# Altium project PA_8CH_CTRL.PrjPcb (part 3 of 3)

## Sheet Power_Supply.SchDoc: Power supply
size 420 x 297 mm; Author: G.K.; CompanyName: WUT; DrawnBy: G.K.; Organization: WUT ISE; Address1: Warsaw Univeristy of Technology; Address2: Nowowiejska 15/19; Revision: -; SheetNumber: -; SheetTotal: -; EDA_Number: ARTIQ; Projet: 8 Channel RF Power Amplifier; ModifiedBy: -; CreateDate: XX/XX/XXXX; CheckedDate: -; Title2: & Power Good detector; DivGrp: ISE; Designer: G.K.; ModifiedDate: -; ProjectName: 8 Channel RF Power Amplifier
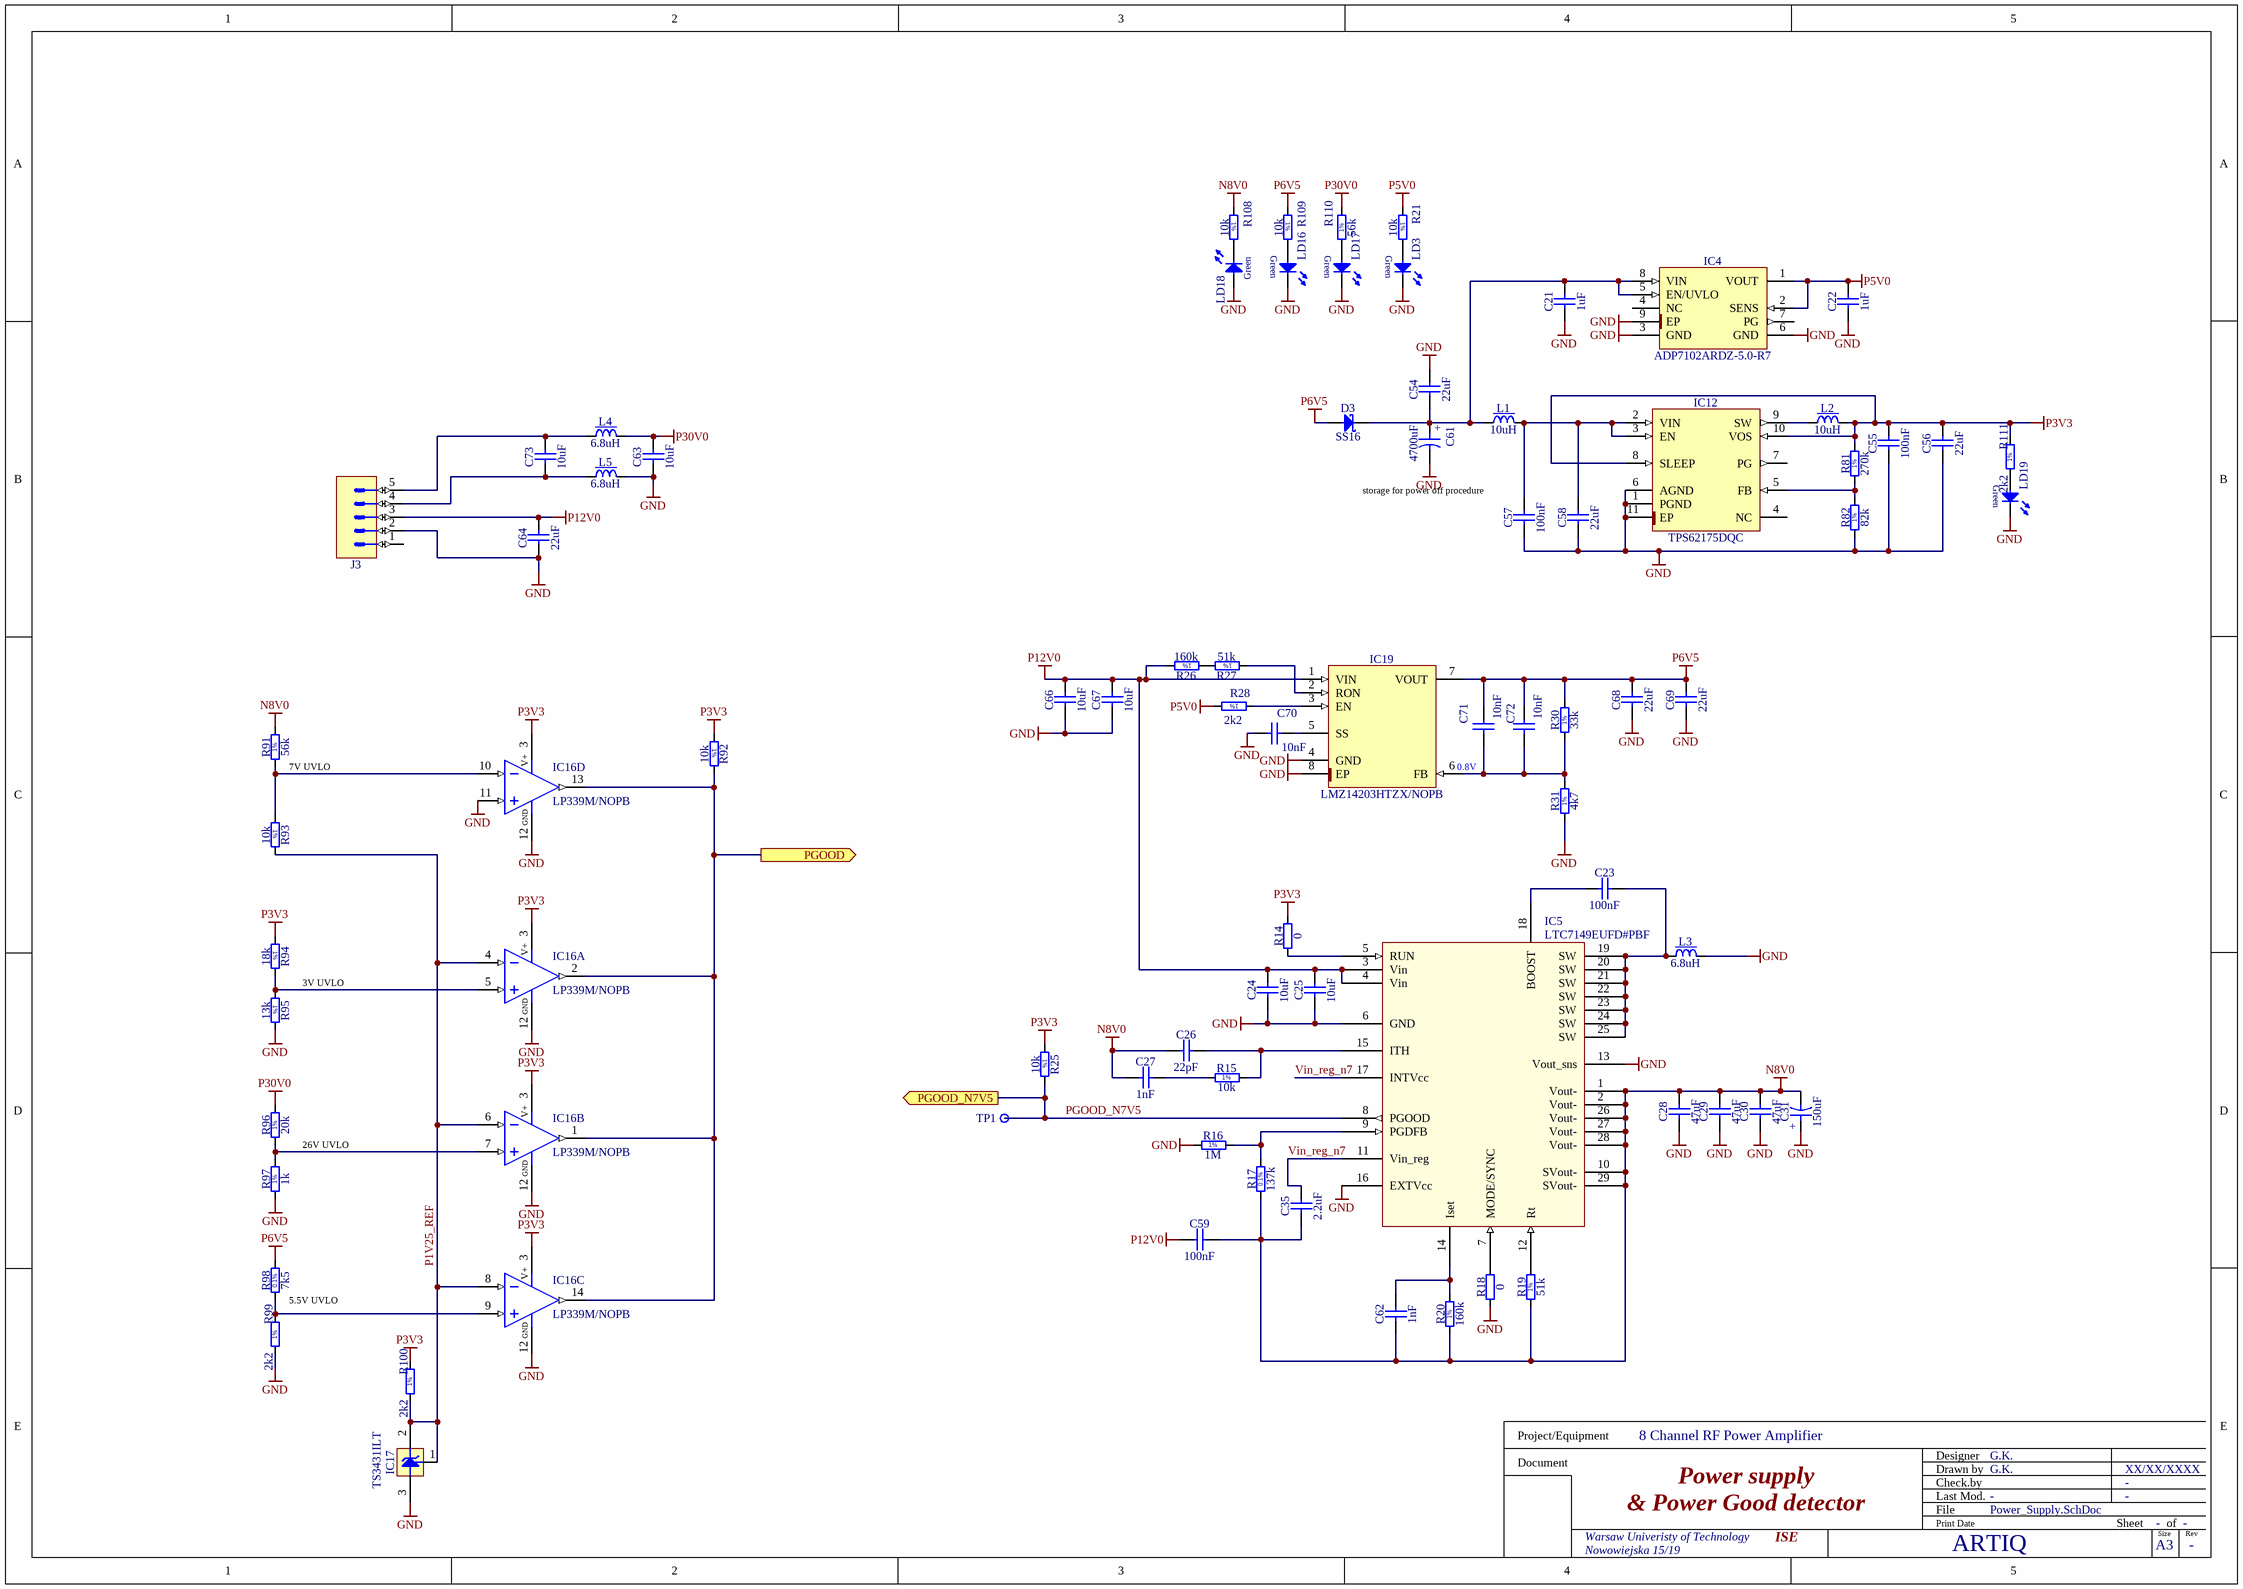
[diagram p3: Power_Supply.SchDoc]

### Parts
C21  1uF  [CAPC2012X140N]
C22  1uF  [CAPC2012X140N]
C23  100nF  [CAPC1005X55N]
C24  10uF  [CAPC3216X190N]
C25  10uF  [CAPC3216X190N]
C26  22pF  [CAPC1005X55N]
C27  1nF  [CAPC1005X55N]
C28  47uF  [CAPC3216X180N]
C29  47uF  [CAPC3216X180N]
C30  47uF  [CAPC3216X180N]
C31  150uF  [CAPMP7343X310N]
C35  2.2uF  [CAPC1608X87N]
C54  22uF  [CAPC2012X135N]
C55  100nF  [CAPC1005X55N]
C56  22uF  [CAPC2012X135N]
C57  100nF  [CAPC1005X55N]
C58  22uF  [CAPC2012X135N]
C59  100nF  [CAPC1608X87N]
C61  4700uF  [CAPAE1900X1680N]
C62  1nF  [CAPC1005X55N]
C63  10uF  [CAPC3216X190N]
C64  22uF  [CAPC2012X135N]
C66  10uF  [CAPC3216X190N]
C67  10uF  [CAPC3216X190N]
C68  22uF  [CAPC2012X135N]
C69  22uF  [CAPC2012X135N]
C70  10nF  [CAPC1608X87N]
C71  10nF  [CAPC1608X87N]
C72  10nF  [CAPC1608X87N]
C73  10uF  [CAPC3216X190N]
D3  SS16  [DIOM5127X229N]
IC4  ADP7102ARDZ-5.0-R7  [SOIC127P600X175-9N-R241X309]
IC5  LTC7149EUFD#PBF  [QFN50P400X500X80_HS-29N]
IC12  TPS62175DQC  [SON50P200X300X80-11N-R94X250]
IC16  LP339M/NOPB  [SOIC127P600X175-14N]  (parts A,B,C,D of 4)
IC17  TS3431ILT  [SOT95P237X112-3N]
IC19  LMZ14203HTZX/NOPB  [TEXAS_TO-PMOD (NDW)]
J3  (no value)  [PHOENIX_1755765]
L1  10uH  [IND_MURATA-PS_8400]
L2  10uH  [IND_MURATA-PS_8400]
L3  6.8uH  [INDM6965X300N]
L4  6.8uH  [INDM6965X300N]
L5  6.8uH  [INDM6965X300N]
LD3  Green  [LED_KINGBRIGHT_KPH-1608CGCK]  (value not drawn)
LD16  Green  [LED_KINGBRIGHT_KPH-1608CGCK]  (value not drawn)
LD17  Green  [LED_KINGBRIGHT_KPH-1608CGCK]  (value not drawn)
LD18  Green  [LED_KINGBRIGHT_KPH-1608CGCK]  (value not drawn)
LD19  Green  [LED_OSRAM_LGL29K]  (value not drawn)
R14  0  [RESC1005X40N]
R15  10k  [RESC1005X40N]
R16  1M  [RESC1005X40N]
R17  137k  [RESC1608X55N]
R18  0  [RESC1005X40N]
R19  51k  [RESC1005X40N]
R20  160k  [RESC1005X40N]
R21  10k  [RESC1005X40N]
R25  10k  [RESC1005X40N]
R26  160k  [RESC1005X40N]
R27  51k  [RESC1005X40N]
R28  2k2  [RESC1005X40N]
R30  33k  [RESC1608X55N]
R31  4k7  [RESC1608X55N]
R81  270k  [RESC1608X55N]
R82  82k  [RESC1608X55N]
R91  56k  [RESC1608X55N]
R92  10k  [RESC1005X40N]
R93  10k  [RESC1005X40N]
R94  18k  [RESC1608X55N]
R95  13k  [RESC1608X55N]
R96  20k  [RESC1608X55N]
R97  1k  [RESC1608X55N]
R98  7k5  [RESC1608X55N]
R99  2k2  [RESC1005X40N]
R100  2k2  [RESC1005X40N]
R108  10k  [RESC1005X40N]
R109  10k  [RESC1005X40N]
R110  56k  [RESC1608X55N]
R111  2k2  [RESC1005X40N]
TP1  Test Point  [TPS127]  (value not drawn)

### Ports
PGOOD (out), PGOOD_N7V5 (out)

### Nets
GND: C21.1 C22.1 C24.1 C25.1 C28.1 C29.1 C30.1 C31.1 C54.2 C55.1 C56.1 C57.1 C58.1 C61.2 C63.1 C64.1 C66.1 C67.1 C68.1 C69.1 C70.1 IC4.3(GND) IC4.6(GND) IC4.9(EP) IC5.6(GND) IC5.13(Vout_sns) IC5.16(EXTVcc) IC12.1(PGND) IC12.6(AGND) IC12.11(EP) IC16.11(IN+) IC16.12(GND) IC17.3(A) IC19.4(GND) IC19.8(EP) J3.2 L3.2 L5.2 LD3.1(C) LD16.1(C) LD17.1(C) LD18.2(A) LD19.1(C) R16.1 R18.1 R31.1 R82.1 R95.2 R97.1 R99.1
N8V0: C26.1 C27.1 C28.2 C29.2 C30.2 C31.2 C35.1 C59.2 C62.1 IC5.1(Vout-) IC5.2(Vout-) IC5.10(SVout-) IC5.26(Vout-) IC5.27(Vout-) IC5.28(Vout-) IC5.29(SVout-) R17.1 R19.1 R20.1 R91.2 R108.1
P3V3: C55.2 C56.2 IC12.8(SLEEP) IC12.10(VOS) IC16.3(V+) L2.2 R14.2 R25.1 R81.2 R92.1 R94.1 R100.2 R111.2
P5V0: C22.2 IC4.1(VOUT) IC4.2(SENS) R21.1 R28.2
P6V5: C68.2 C69.2 C71.2 C72.2 D3.2(A) IC19.7(VOUT) R30.2 R98.2 R109.1
P12V0: C24.2 C25.2 C59.1 C64.2 C66.2 C67.2 IC5.3(Vin) IC5.4(Vin) IC19.1(VIN) J3.3 R26.2
P30V0: C63.2 L4.2 R96.2 R110.2
P1V25_REF: IC16.4(IN-) IC16.6(IN-) IC16.8(IN-) IC17.1(Adj) IC17.2(C) R93.2 R100.1
PGOOD_N7V5: IC5.8(PGOOD) R25.2 TP1.1 ; port PGOOD_N7V5
Vin_reg_n7: C35.2 IC5.11(Vin_reg) IC5.17(INTVcc)
NetC21_2: C21.2 C54.1 C61.1 D3.1(C) IC4.5(EN/UVLO) IC4.8(VIN) L1.1
NetC23_1: C23.1 IC5.18(BOOST)
NetC23_2: C23.2 IC5.19(SW) IC5.20(SW) IC5.21(SW) IC5.22(SW) IC5.23(SW) IC5.24(SW) IC5.25(SW) L3.1
NetC26_2: C26.2 IC5.15(ITH) R15.2
NetC27_2: C27.2 R15.1
NetC57_2: C57.2 C58.2 IC12.2(VIN) IC12.3(EN) L1.2
NetC62_2: C62.2 IC5.14(Iset) R20.2
NetC70_2: C70.2 IC19.5(SS)
NetC71_1: C71.1 C72.1 IC19.6(FB) R30.1 R31.2
NetC73_1: C73.1 J3.4 L5.1
NetC73_2: C73.2 J3.5 L4.1
NetD2_1_1: IC16.1(OUT) IC16.2(OUT) IC16.13(OUT) IC16.14(OUT) R92.2 ; port PGOOD
NetIC5_5: IC5.5(RUN) R14.1
NetIC5_7: IC5.7(MODE/SYNC) R18.2
NetIC5_9: IC5.9(PGDFB) R16.2 R17.2
NetIC5_12: IC5.12(Rt) R19.2
NetIC12_5: IC12.5(FB) R81.1 R82.2
NetIC12_9: IC12.9(SW) L2.1
NetIC16_5: IC16.5(IN+) R94.2 R95.1
NetIC16_7: IC16.7(IN+) R96.1 R97.2
NetIC16_9: IC16.9(IN+) R98.1 R99.2
NetIC16_10: IC16.10(IN-) R91.1 R93.1
NetIC19_2: IC19.2(RON) R27.1
NetIC19_3: IC19.3(EN) R28.1
NetLD3_2: LD3.2(A) R21.2
NetLD16_2: LD16.2(A) R109.2
NetLD17_2: LD17.2(A) R110.1
NetLD18_1: LD18.1(C) R108.2
NetLD19_2: LD19.2(A) R111.1
NetR26_1: R26.1 R27.2

Not connected (* = marked no-connect by the designer): IC4 4(NC) 7(PG); IC12 4(NC) 7(PG); J3 1

### Notes on the sheet
- (near C57) storage for power off procedure
- (near R91) 7V UVLO
- 0.8V
- 3V UVLO
- 26V UVLO
- 5.5V UVLO
- Project/Equipment
- Document
- Designer
- Drawn by
- Check.by
- File
- Last Mod.
- Print Date
- Sheet
- Size
- A3
- of
- Rev
- (in symbol CAE1900-1680_4700UF_16V_20%) +
- (in symbol CTE7343-31_150UF_16V_10%_LESR0100) +
- (in symbol R0402_1M_1%_0.0625W_100PPM) 1%
- (in symbol R0402_2K2_1%_0.0625W_100PPM) 1%
- (in symbol R0402_10K_1%_0.0625W_100PPM) 1%
- (in symbol R0402_51K_1%_0.0625W_100PPM) 1%
- (in symbol R0402_160K_1%_0.0625W_100PPM) 1%
- (in symbol R0603_1K_1%_0.1W_100PPM) 1%
- (in symbol R0603_4K7_1%_0.1W_100PPM) 1%
- (in symbol R0603_7K5_0.1%_0.063W_10PPM) 0.1%
- (in symbol R0603_13K_1%_0.1W_100PPM) 1%
- (in symbol R0603_18K_1%_0.1W_100PPM) 1%
- (in symbol R0603_20K_1%_0.1W_100PPM) 1%
- (in symbol R0603_33K_1%_0.1W_100PPM) 1%
- (in symbol R0603_56K_1%_0.1W_100PPM) 1%
- (in symbol R0603_82K_1%_0.1W_100PPM) 1%
- (in symbol R0603_137K_0.1%_0.063W_10PPM) 0.1%
- (in symbol R0603_270K_1%_0.1W_100PPM) 1%

### Library data of the parts
C21 C22 = CC0805_1UF_35V_20%_X7R: Non-polarised capacitor; Part Description: SMD Multilayer Chip Ceramic Capacitor; Manufacturer: GENERIC; Manufacturer1 Part Number: GMK212B7105MG-T; Voltage: 35V; TC: X7R; Tolerance: ±20%; Part Number: CC0805_1UF_35V_20%_X7R; Component Kind: Standard; Component Type: Standard; Pin Count: 2; Value: 1uF; Status: Not Recommended; Manufacturer Part Number: CC0805_1UF_35V_20%_X7R; Case: 0805; Mounted: Yes; Socket: No; SMD: Yes; Sense: No; Manufacturer1 Example: TAIYO YUDEN; Manufacturer1 ComponentHeight: 1.35mm; HelpURL: \\cern.ch\dfs\Applications\Altium\Datasheets\CC0805_X7R_TAIYO-YUDEN_HIGH-VALUE.pdf; Author: CERN DEM JLC; CreateDate: 22.06.2011; LatestRevisionDate: 22.06.2011
C23 = CC0402_100NF_16V_10%_X7R: Non-polarised capacitor; Part Description: SMD Multilayer Chip Ceramic Capacitor; Manufacturer: GENERIC; Manufacturer1 Part Number: GRM155R71C104KA88D; Voltage: 16V; TC: X7R; Tolerance: ±10%; Part Number: CC0402_100NF_16V_10%_X7R; Component Kind: Standard; Component Type: Standard; Pin Count: 2; Value: 100nF; Status: Not Recommended; Manufacturer Part Number: CC0402_100NF_16V_10%_X7R; Case: 0402; Mounted: Yes; Socket: No; SMD: Yes; Sense: No; Manufacturer1 Example: MURATA; Manufacturer1 ComponentHeight: 0.55mm; HelpURL: \\cern.ch\dfs\Applications\Altium\Datasheets\CC0402_X7R_MURATA_GRM.pdf; Author: CERN DEM JLC; CreateDate: 05.12.2013; LatestRevisionDate: 03.12.2007
C24 C25 C63 C66 C67 C73 = CC1206_10UF_50V_10%_X5R_TDK_CGA5L3X5R1H106K160AB: Non-polarised capacitor; Part Description: SMD Multilayer Chip Ceramic Capacitor (Automotive Grade); Manufacturer: TDK; Voltage: 50V; TC: X5R; Tolerance: ±10%; Part Number: CC1206_10UF_50V_10%_X5R_TDK_CGA5L3X5R1H106K160AB; Component Kind: Standard; Component Type: Standard; Pin Count: 2; Value: 10uF; Status: Not Recommended; Manufacturer Part Number: CGA5L3X5R1H106K160AB; Case: 1206; Mounted: Yes; Socket: No; SMD: Yes; Sense: No; ComponentHeight: 1.9mm; HelpURL: \\cern.ch\dfs\Applications\Altium\Datasheets\CC1206_X5R_TDK_CGA.pdf; Author: CERN DEM BC; CreateDate: 29.02.2016; LatestRevisionDate: 13.09.2016
C26 = CC0402_22PF_50V_5%_C0G: Non-polarised capacitor; Part Description: SMD Multilayer Chip Ceramic Capacitor; Manufacturer: GENERIC; Manufacturer1 Part Number: C0402C220J5GACTU; Voltage: 50V; TC: C0G/NP0; Tolerance: ±5%; Part Number: CC0402_22PF_50V_5%_C0G; Component Kind: Standard; Component Type: Standard; Pin Count: 2; Value: 22pF; Status: Preferred; Manufacturer Part Number: CC0402_22PF_50V_5%_C0G; Case: 0402; Mounted: Yes; Socket: No; SMD: Yes; Sense: No; Manufacturer1 Example: KEMET; Manufacturer1 ComponentHeight: 0.55mm; HelpURL: \\cern.ch\dfs\Applications\Altium\Datasheets\CC0805_C0G_KEMET_(Commercial Grade).pdf; Author: CERN DEM JLC; CreateDate: 03.12.2007; LatestRevisionDate: 03.12.2007
C27 C62 = CC0402_1NF_50V_10%_X7R: Non-polarised capacitor; Part Description: SMD Multilayer Chip Ceramic Capacitor; Manufacturer: GENERIC; Manufacturer1 Part Number: 223858715623; Voltage: 50V; TC: X7R; Tolerance: ±10%; Part Number: CC0402_1NF_50V_10%_X7R; Component Kind: Standard; Component Type: Standard; Pin Count: 2; Value: 1nF; Status: Not Recommended; Manufacturer Part Number: CC0402_1NF_50V_10%_X7R; Case: 0402; Mounted: Yes; Socket: No; SMD: Yes; Sense: No; Manufacturer1 Example: PHYCOMP; Manufacturer1 ComponentHeight: 0.55mm; HelpURL: \\cern.ch\dfs\Applications\Altium\Datasheets\CC0402_X7R_PHYCOMP.pdf; Author: CERN DEM JLC; CreateDate: 03.12.2007; LatestRevisionDate: 03.12.2007
C28-C30 = CC1206_47UF_25V_20%_X5R: Non-polarised capacitor; Part Description: SMD Multilayer Chip Ceramic Capacitor; Manufacturer: TDK; Manufacturer Part Number: C3216X5R1E476M160AC; Voltage: 25V; TC: X5R; Tolerance: ±20%; Part Number: CC1206_47UF_25V_20%_X5R; Component Kind: Standard; Component Type: Standard; Pin Count: 2; Value: 47uF; Status: None; Case: 1206; Mounted: Yes; Socket: No; SMD: Yes; Sense: No; ComponentHeight: 1.8mm; HelpURL: \\cern.ch\dfs\Applications\Altium\Datasheets\CC1206_X5R_TDK_C.pdf; Author: CERN DEM JLC; CreateDate: 20.11.2013; LatestRevisionDate: 20.11.2013
C31 = CTE7343-31_150UF_16V_10%_LESR0100: Polarised capacitor; Part Description: Low ESR 0R1 Solid Tantalum Chip Capacitor; Manufacturer: GENERIC; Manufacturer1 Part Number: TPSD157K016R0100; Voltage: 16V; Tolerance: ±10%; Part Number: CTE7343-31_150UF_16V_10%_LESR0100; Component Kind: Standard; Component Type: Standard; Pin Count: 2; Value: 150uF; Status: Preferred; Manufacturer Part Number: CTE7343-31_150UF_16V_10%_LESR0100; Case: D; Mounted: Yes; Socket: No; SMD: Yes; Sense: No; Manufacturer1 Example: AVX; Manufacturer1 ComponentHeight: 3.1mm; HelpURL: \\cern.ch\dfs\Applications\Altium\Datasheets\CTE-LESR_AVX_TPS.pdf; Author: CERN DEM JLC; CreateDate: 05.05.2008; LatestRevisionDate: 20.01.2009
C35 = CC0603_2.2UF_16V_10%_X5R: Non-polarised capacitor; Part Description: SMD Multilayer Chip Ceramic Capacitor; Manufacturer: GENERIC; Manufacturer1 Part Number: CC0603KRX5R7BB225; Voltage: 16V; TC: X5R; Tolerance: ±10%; Part Number: CC0603_2.2UF_16V_10%_X5R; Component Kind: Standard; Component Type: Standard; Pin Count: 2; Value: 2.2uF; Status: Preferred; Manufacturer Part Number: CC0603_2.2UF_16V_10%_X5R; Case: 0603; Mounted: Yes; Socket: No; SMD: Yes; Sense: No; Manufacturer1 Example: YAGEO; Manufacturer1 ComponentHeight: 0.9mm; HelpURL: \\cern.ch\dfs\Applications\Altium\Datasheets\CC0805_X5R_PHYCOMP_HC.pdf; Author: CERN DEM JLC; CreateDate: 28.04.2011; LatestRevisionDate: 28.04.2011
C54 C56 C58 C64 C68 C69 = CC0805_22UF_16V_10%_X5R: Non-polarised capacitor; Part Description: SMD Multilayer Chip Ceramic Capacitor; Manufacturer: GENERIC; Manufacturer1 Part Number: C2012X5R1C226KT; Voltage: 16V; TC: X5R; Tolerance: ±10%; Part Number: CC0805_22UF_16V_10%_X5R; Component Kind: Standard; Component Type: Standard; Pin Count: 2; Value: 22uF; Status: Preferred; Manufacturer Part Number: CC0805_22UF_16V_10%_X5R; Case: 0805; Mounted: Yes; Socket: No; SMD: Yes; Sense: No; Manufacturer1 Example: TDK; Manufacturer1 ComponentHeight: 1.35mm; HelpURL: \\cern.ch\dfs\Applications\Altium\Datasheets\CC0805_X5R_TDK_C.pdf; Author: CERN DEM JLC; CreateDate: 25.10.2012; LatestRevisionDate: 25.10.2012
C55 C57 = CC0402_100NF_16V_10%_X5R: Non-polarised capacitor; Part Description: SMD Multilayer Chip Ceramic Capacitor; Manufacturer: GENERIC; Manufacturer1 Part Number: GRM155R61C104KA88D; Voltage: 16V; TC: X5R; Tolerance: ±10%; Part Number: CC0402_100NF_16V_10%_X5R; Component Kind: Standard; Component Type: Standard; Pin Count: 2; Value: 100nF; Status: None; Manufacturer Part Number: CC0402_100NF_16V_10%_X5R; Case: 0402; Mounted: Yes; Socket: No; SMD: Yes; Sense: No; Manufacturer1 Example: MURATA; Manufacturer1 ComponentHeight: 0.55mm; HelpURL: \\cern.ch\dfs\Applications\Altium\Datasheets\CC0402_X5R_MURATA_GRM.pdf; Author: CERN DEM JLC; CreateDate: 10.12.2013; LatestRevisionDate: 10.12.2013
C59 = CC0603_100NF_50V_10%_X5R: Non-polarised capacitor; Part Description: SMD Multilayer Chip Ceramic Capacitor; Manufacturer: GENERIC; Manufacturer1 Part Number: C1608X5R1H104K080AA; Voltage: 50V; TC: X5R; Tolerance: ±10%; Part Number: CC0603_100NF_50V_10%_X5R; Component Kind: Standard; Component Type: Standard; Pin Count: 2; Value: 100nF; Status: None; Manufacturer Part Number: CC0603_100NF_50V_10%_X5R; Case: 0603; Mounted: Yes; Socket: No; SMD: Yes; Sense: No; Manufacturer1 Example: TDK; Manufacturer1 ComponentHeight: 0.9mm; HelpURL: \\cern.ch\dfs\Applications\Altium\Datasheets\CC0603_X5R_TDK_C.pdf; Author: CERN DEM MR; CreateDate: 08.01.2016; LatestRevisionDate: 08.01.2016
C61 = CAE1900-1680_4700UF_16V_20%: Polarised capacitor; Part Description: Aluminum Electrolytic SMT Capacitor; Manufacturer: PANASONIC; Manufacturer Part Number: EEVFK1C472M; Voltage: 16V; Tolerance: ±20%; Part Number: CAE1900-1680_4700UF_16V_20%; Component Kind: Standard; Component Type: Standard; Pin Count: 2; Value: 4700uF; Status: Not Recommended; Case: K16; Mounted: Yes; Socket: No; SMD: Yes; Sense: No; ComponentHeight: 16.8mm; HelpURL: \\cern.ch\dfs\Applications\Altium\Datasheets\CAE_PANASONIC_FK.pdf; Author: CERN DEM JLC; CreateDate: 05.11.2014; LatestRevisionDate: 05.11.2014
C70-C72 = CC0603_10NF_50V_5%_C0G: Non-polarised capacitor; Part Description: SMD Multilayer Chip Ceramic Capacitor; Manufacturer: GENERIC; Manufacturer1 Part Number: C1608C0G1H103J080AA; Voltage: 50V; TC: C0G/NP0; Tolerance: ±5%; Part Number: CC0603_10NF_50V_5%_C0G; Component Kind: Standard; Component Type: Standard; Pin Count: 2; Value: 10nF; Status: Preferred; Manufacturer Part Number: CC0603_10NF_50V_5%_C0G; Case: 0603; Mounted: Yes; Socket: No; SMD: Yes; Sense: No; Manufacturer1 Example: TDK; Manufacturer1 ComponentHeight: 0.9mm; HelpURL: \\cern.ch\dfs\Applications\Altium\Datasheets\CC0603_C0G_TDK_C.pdf; Author: CERN DEM JLC; CreateDate: 10.12.2014; LatestRevisionDate: 10.12.2014
D3 = SS16: Schottky Diode; Part Description: Surface Mount Schottky Barrier Rectifier; Manufacturer: VISHAY GENERAL SEMICONDUCTOR; Voltage: 60V; Power: 1A; PressFit: No; Bonding: No; Part Number: SS16; Component Kind: Standard; Component Type: Standard; Device: SS16; PackageDescription: DO-214-AC Molded Diode, Body 5.1x2.7mm, IPC Medium Density; Manufacturer Part Number: SS16; Pin Count: 2; Case: DO-214AC; Mounted: Yes; Socket: No; SMD: Yes; Sense: No; ComponentHeight: 2.29mm; HelpURL: \\cern.ch\dfs\Applications\Altium\Datasheets\SS16.pdf; Author: CERN DEM JLC; CreateDate: 15.07.2008; LatestRevisionDate: 23.08.2010
IC4 = ADP7102ARDZ-5.0-R7: 300 mA, Low Noise, CMOS LDO Linear Regulator; Part Description: 5V, 300mA, Low Noise, CMOS LDO Linear Regulator; Manufacturer: ANALOG DEVICES; PressFit: No; Bonding: No; Part Number: ADP7102ARDZ-5.0-R7; Component Kind: Standard; Component Type: Standard; Device: ADP7102ARDZ-5.0-R7; PackageDescription: SOIC 8, Pitch 1.27mm - Body 3.9x4.9mm, (w/thermal tab 2.41mm X 3.098mm), IPC Medium Density; Manufacturer Part Number: ADP7102ARDZ-5.0-R7; Pin Count: 8; Case: SOIC8; Mounted: Yes; Socket: No; SMD: Yes; Sense: No; ComponentHeight: 1.75mm; HelpURL: \\cern.ch\dfs\Applications\Altium\Datasheets\ADP7102ARDZ-5.0-R7.pdf; Author: CERN DEM JLC; CreateDate: 17.03.2014; LatestRevisionDate: 17.03.2014
IC5 = LTC7149EUFD#PBF: LTC7149 - 60V, 4A Synchronous Step-Down Regulator for Inverting Outputs; Manufacturer: Linear technology; Manufacturer Part Number: LTC7149EUFD#PBF
IC12 = TPS62175DQC: 4.75-28VDC to 1-6VDC, 500mA Step-Down Converter With Sleep Mode; Manufacturer: TEXAS INSTRUMENTS; PressFit: No; Bonding: No; Part Number: TPS62175DQC; Component Kind: Standard; Component Type: Standard; Device: TPS62175DQC; PackageDescription: SON, 10-Leads, Body 2x3mm, Pitch 0.5mm, Thermal Pad 0.94x2.5mm, IPC Medium Density; Part Description: 4.75-28VDC to 1-6VDC, 500mA Step-Down Converter With Sleep Mode; Manufacturer Part Number: TPS62175DQC; Pin Count: 11; Case: SON10; Mounted: Yes; Socket: No; SMD: Yes; Sense: No; ComponentHeight: 0.8mm; HelpURL: \\cern.ch\dfs\Applications\Altium\Datasheets\TPS62175DQC.pdf; Author: CERN DEM JMW; CreateDate: 11.08.2015; LatestRevisionDate: 11.08.2015
IC16 = LP339M/NOPB: Quad Operational Amplifier; Part Description: Ultra-Low Power Quad Comparator; Manufacturer: TEXAS INSTRUMENTS; PressFit: No; Bonding: No; Part Number: LP339M/NOPB; Component Kind: Standard; Component Type: Standard; Device: LP339M/NOPB; PackageDescription: SOIC 14, Pitch 1.27mm - Body 4x8.75mm, IPC Medium Density; Manufacturer Part Number: LP339M/NOPB; Pin Count: 14; Case: SOIC14; Mounted: Yes; Socket: No; SMD: Yes; Sense: No; ComponentHeight: 1.75mm; Author: CERN DEM MR; HelpURL: \\cern.ch\dfs\Applications\Altium\Datasheets\LP339M-NOPB.pdf; CreateDate: 23.03.2016; LatestRevisionDate: 23.03.2016
IC17 = TS3431ILT: Precision Reference 1=Adj 2=Cathode 3=Anode; Part Description: 1.24 V Programmable Shunt Voltage Reference; Manufacturer: ST MICROELECTRONICS; PressFit: No; Bonding: No; Part Number: TS3431ILT; Component Kind: Standard; Component Type: Standard; Device: TS3431ILT; PackageDescription: SOT, 0.95mm, pitch; 3 pin,1.30mm W X 2.92mm L X 1.12mm H body, IPC Medium Density; Manufacturer Part Number: TS3431ILT; Pin Count: 3; Case: SOT23; Mounted: Yes; Socket: No; SMD: Yes; Sense: No; ComponentHeight: 1.12mm; HelpURL: \\cern.ch\dfs\Applications\Altium\Datasheets\TS3431ILT.pdf; Author: CERN DEM JLC; CreateDate: 17.11.2016; LatestRevisionDate: 17.11.2016
IC19 = PM_LMZ14203: 3A SIMPLE SWITCHER® Power Module with 42V Maximum Input Voltage; Manufacturer: TEXAS INSTRUMENTS; PressFit: No; Bonding: No; Part Number: LMZ14203HTZX/NOPB; Component Kind: Standard; Component Type: Standard; Device: LMZ14203HTZX/NOPB; PackageDescription: TO-PMOD 7 Pin Package, NATIONAL Package TZA07A, 1.70mm pitch; 9.85mm L X 10.16mm W X 4.67mm H body; Part Description: 3A SIMPLE SWITCHER® Power Module with 42V Maximum Input Voltage; Manufacturer Part Number: LMZ14203HTZX/NOPB; Pin Count: 8; Case: TO-PMOD-7; Mounted: Yes; Socket: No; SMD: Yes; Sense: No; ComponentHeight: 4.67mm; HelpURL: \\cern.ch\dfs\Applications\Altium\Datasheets\LMZ14201EXTTZE-NOPB.pdf; Author: GK; CreateDate: 17.11.2016; LatestRevisionDate: 17.11.2016
J3 = PHOENIX_1755765: Connector 5 Male; Part Description: 12A, 250V, Pitch 5.08mm, 5 Positions Header; Manufacturer: PHOENIX CONTACT; Manufacturer Part Number: 1755765 (MSTBVA 2.5/5-G-5,08); PressFit: No; Part Number: PHOENIX_1755765; Component Kind: Standard; Component Type: Standard; Pin Count: 5; Mounted: Yes; Socket: No; SMD: No; Sense: No; Status: None; ComponentHeight: 12mm; HelpURL: \\cern.ch\dfs\Applications\Altium\Datasheets\PHOENIX_1755765.pdf; Author: CERN DEM JLC; CreateDate: 07.12.2010; LatestRevisionDate: 07.12.2010
L1 L2 = IND_10UH_10%_MURATA-PS_8400: Inductor With Core; Part Description: Miniature Surface Mount Power Inductor (8400 Serie); Manufacturer: MURATA POWER SOLUTIONS; Manufacturer Part Number: 84103C; Power: 950mA; Resistance: 0.24R; Tolerance: ±10%; Part Number: IND_10UH_10%_MURATA-PS_8400; Component Kind: Standard; Component Type: Standard; Pin Count: 2; Value: 10uH; Status: None; Mounted: Yes; Socket: No; SMD: Yes; Sense: No; ComponentHeight: 2.9mm; HelpURL: \\cern.ch\dfs\Applications\Altium\Datasheets\IND_MURATA-PS_8400.pdf; Author: CERN DEM JLC; CreateDate: 02.07.2012; LatestRevisionDate: 02.07.2012
L3-L5 = IND2525_1.5UH_20%_VISHAY_IHLP-2525CZ: Inductor With Core; Part Description: Low Profile, High Current IHLP® Inductor; Manufacturer: VISHAY DALE; Manufacturer Part Number: IHLP2525CZER6R8M01; Power: 9A; Resistance: 0.014R; Tolerance: ±20%; Note: Replace with IHLP2525CZER6R8M01; Part Number: IND2525_1.5UH_20%_VISHAY_IHLP-2525CZ; Component Kind: Standard; Component Type: Standard; Pin Count: 2; Value: 6.8uH; Status: None; Case: 2525; Mounted: Yes; Socket: No; SMD: Yes; Sense: No; ComponentHeight: 3mm; HelpURL: \\cern.ch\dfs\Applications\Altium\Datasheets\IND2525_VISHAY_IHLP-2525CZ.pdf; Author: CERN DEM JLC; CreateDate: 24.10.2012; LatestRevisionDate: 24.10.2012
LD3 LD16-LD18 = LED_KINGBRIGHT_KPH-1608CGCK: LED Green 1C 2A; Part Description: SMD Green LED, Case 1.6mmX0.8mm(0603), 0.65mm Thickness; PressFit: No; Bonding: No; Part Number: LED_KINGBRIGHT_KPH-1608CGCK; Component Kind: Standard; Component Type: Standard; Color: Green; PackageDescription: SMT Green LED, Case 0603, Body L 1.6 x W 0.8mm H 0.65mm; Manufacturer: KINGBRIGHT; Manufacturer Part Number: KPH-1608CGCK; Pin Count: 2; Mounted: Yes; Socket: No; SMD: Yes; Sense: No; ComponentHeight: 0.65mm; HelpURL: \\cern.ch\dfs\Applications\Altium\Datasheets\LED_KINGBRIGHT_KPH-1608CGCK.pdf; Author: CERN DEM JLC; CreateDate: 03.07.2017; LatestRevisionDate: 03.07.2017
LD19 = LED_OSRAM_LG L29K-G2J1-24-Z: LED Green 1C 2A; Part Description: Surface Mount Green LED (0603 Case); Manufacturer: OSRAM; PressFit: No; Bonding: No; Part Number: LED_OSRAM_LG L29K-G2J1-24-Z; Component Kind: Standard; Component Type: Standard; Color: Green; PackageDescription: Green Chip LED, 2-Leads, Body 1.7x0.8mm, IPC Medium Density; Manufacturer Part Number: LG L29K-G2J1-24-Z; Pin Count: 2; Case: 0603; Mounted: Yes; Socket: No; SMD: Yes; Sense: No; ComponentHeight: 0.67mm; HelpURL: \\cern.ch\dfs\Applications\Altium\Datasheets\LED_OSRAM_LGL29K.pdf; Author: CERN DEM JLC; CreateDate: 24.04.2012; LatestRevisionDate: 24.04.2012
R14 R18 = R0402_0R_JUMPER: Resistor; Part Description: 1A (0.05R Max DC Resistance) Zero Ohm Jumper; Manufacturer: GENERIC; Manufacturer1 Part Number: 232270591001L; Mounted: No; Part Number: R0402_0R_JUMPER; Component Kind: Standard; Component Type: Standard; Pin Count: 2; Value: 0; Status: Not recommended; Manufacturer Part Number: R0402_0R_JUMPER; Case: 0402; Sense: No; Socket: No; SMD: Yes; Manufacturer1 Example: YAGEO PHYCOMP; Manufacturer1 ComponentHeight: 0.4mm; HelpURL: \\cern.ch\dfs\Applications\Altium\Datasheets\R0402_Phycomp_RC0402.pdf; Author: CERN DEM JLC; CreateDate: 03.12.2007; LatestRevisionDate: 17.10.2012
R15 = R0402_10K_1%_0.0625W_100PPM: Resistor - 1%; Part Description: General Purpose Thick Film Chip Resistor; Manufacturer: GENERIC; Manufacturer1 Part Number: 232270671003L; TC: ±100ppm/°C; Part Number: R0402_10K_1%_0.0625W_100PPM; Component Kind: Standard; Component Type: Standard; Pin Count: 2; Value: 10k; Status: Not recommended; Power: 0.0625W; Tolerance: ±1%; Manufacturer Part Number: R0402_10K_1%_0.0625W_100PPM; Case: 0402; Mounted: Yes; Sense: No; Socket: No; SMD: Yes; Manufacturer1 Example: YAGEO PHYCOMP; Manufacturer1 ComponentHeight: 0.4mm; HelpURL: \\cern.ch\dfs\Applications\Altium\Datasheets\R0402_Phycomp_RC0402.pdf; Author: CERN DEM JLC; CreateDate: 03.12.2007; LatestRevisionDate: 17.10.2012
R16 = R0402_1M_1%_0.0625W_100PPM: Resistor - 1%; Part Description: General Purpose Thick Film Chip Resistor; Manufacturer: GENERIC; Manufacturer1 Part Number: 232270671005L; TC: ±100ppm/°C; Part Number: R0402_1M_1%_0.0625W_100PPM; Component Kind: Standard; Component Type: Standard; Pin Count: 2; Value: 1M; Status: Not recommended; Power: 0.0625W; Tolerance: ±1%; Manufacturer Part Number: R0402_1M_1%_0.0625W_100PPM; Case: 0402; Mounted: Yes; Sense: No; Socket: No; SMD: Yes; Manufacturer1 Example: YAGEO PHYCOMP; Manufacturer1 ComponentHeight: 0.4mm; HelpURL: \\cern.ch\dfs\Applications\Altium\Datasheets\R0402_Phycomp_RC0402.pdf; Author: CERN DEM JLC; CreateDate: 03.12.2007; LatestRevisionDate: 17.10.2012
R17 = R0603_137K_0.1%_0.063W_10PPM: Resistor - 0.1%; Part Description: Thin Film Chip Resistor; Manufacturer: GENERIC; Manufacturer1 Part Number: RN73C1J137KBTDF; Power: 0.063W; TC: ±10ppm; Part Number: R0603_137K_0.1%_0.063W_10PPM; Component Kind: Standard; Component Type: Standard; Pin Count: 2; Value: 137k; Status: Not recommended; Tolerance: ±0.1%; Manufacturer Part Number: R0603_137K_0.1%_0.063W_10PPM; Case: 0603; Mounted: Yes; Sense: No; Socket: No; SMD: Yes; Manufacturer1 Example: TYCO HOLSWORTHY; Manufacturer1 ComponentHeight: 0.5mm; HelpURL: \\cern.ch\dfs\Applications\Altium\Datasheets\R0603_Tyco_RN73.pdf; Author: CERN DEM JLC; CreateDate: 03.12.2007; LatestRevisionDate: 13.03.2008
R19 R27 = R0402_51K_1%_0.0625W_100PPM: Resistor - 1%; Part Description: General Purpose Thick Film Chip Resistor; Manufacturer: GENERIC; Manufacturer1 Part Number: 232270674703L; TC: ±100ppm/°C; Part Number: R0402_51K_1%_0.0625W_100PPM; Component Kind: Standard; Component Type: Standard; Pin Count: 2; Value: 51k; Status: Not recommended; Power: 0.0625W; Tolerance: ±1%; Manufacturer Part Number: R0402_51K_1%_0.0625W_100PPM; Case: 0402; Mounted: Yes; Sense: No; Socket: No; SMD: Yes; Manufacturer1 Example: YAGEO PHYCOMP; Manufacturer1 ComponentHeight: 0.4mm; HelpURL: \\cern.ch\dfs\Applications\Altium\Datasheets\R0402_Phycomp_RC0402.pdf; Author: CERN DEM JLC; CreateDate: 03.12.2007; LatestRevisionDate: 17.10.2012
R20 R26 = R0402_160K_1%_0.0625W_100PPM: Resistor - 1%; Part Description: General Purpose Thick Film Chip Resistor; Manufacturer: GENERIC; Manufacturer1 Part Number: 232270671604L; TC: ±100ppm/°C; PressFit: No; Part Number: R0402_160K_1%_0.0625W_100PPM; Component Kind: Standard; Component Type: Standard; Pin Count: 2; Value: 160k; Status: Not Recommended; Power: 0.0625W; Tolerance: ±1%; Manufacturer Part Number: R0402_160K_1%_0.0625W_100PPM; Case: 0402; Mounted: Yes; Sense: No; Socket: No; SMD: Yes; Manufacturer1 Example: YAGEO PHYCOMP; Manufacturer1 ComponentHeight: 0.4mm; HelpURL: \\cern.ch\dfs\Applications\Altium\Datasheets\R0402_Phycomp_RC0402.pdf; Author: CERN DEM JLC; CreateDate: 03.12.2007; LatestRevisionDate: 17.10.2012
R21 R25 R92 R93 R108 R109 = R0402_10K_1%_0.0625W_100PPM: as R22 on sheet PA_CTRL_TOP; Part Number: R0402_10K_1%_0.0625W_100PPM; Component Kind: Standard; Component Type: Standard; Pin Count: 2; Value: 10k; Status: Not recommended; Power: 0.0625W; Tolerance: ±1%; Manufacturer Part Number: R0402_10K_1%_0.0625W_100PPM; Case: 0402; Mounted: Yes; Socket: No; SMD: Yes; Manufacturer1 Example: YAGEO PHYCOMP; Manufacturer1 ComponentHeight: 0.4mm; HelpURL: \\cern.ch\dfs\Applications\Altium\Datasheets\R0402_Phycomp_RC0402.pdf; Author: CERN DEM JLC; CreateDate: 2007-12-03; LatestRevisionDate: 2012-10-17
R28 R99 R100 R111 = R0402_2K2_1%_0.0625W_100PPM: Resistor - 1%; Part Description: General Purpose Thick Film Chip Resistor; Manufacturer: GENERIC; Manufacturer1 Part Number: 232270672202L; TC: ±100ppm/°C; Part Number: R0402_2K2_1%_0.0625W_100PPM; Component Kind: Standard; Component Type: Standard; Pin Count: 2; Value: 2k2; Status: Not recommended; Power: 0.0625W; Tolerance: ±1%; Manufacturer Part Number: R0402_2K2_1%_0.0625W_100PPM; Case: 0402; Mounted: Yes; Sense: No; Socket: No; SMD: Yes; Manufacturer1 Example: YAGEO PHYCOMP; Manufacturer1 ComponentHeight: 0.4mm; HelpURL: \\cern.ch\dfs\Applications\Altium\Datasheets\R0402_Phycomp_RC0402.pdf; Author: CERN DEM JLC; CreateDate: 03.12.2007; LatestRevisionDate: 17.10.2012
R30 = R0603_33K_1%_0.1W_100PPM: Resistor - 1%; Part Description: General Purpose Thick Film Chip Resistor; Manufacturer: GENERIC; Manufacturer1 Part Number: NRC06F3302TRF; Power: 0.1W; TC: ±100ppm/°C; PressFit: No; Part Number: R0603_33K_1%_0.1W_100PPM; Component Kind: Standard; Component Type: Standard; Pin Count: 2; Value: 33k; Status: Preferred; Tolerance: ±1%; Manufacturer Part Number: R0603_33K_1%_0.1W_100PPM; Case: 0603; Mounted: Yes; Sense: No; Socket: No; SMD: Yes; Manufacturer1 Example: NIC COMPONENT; Manufacturer1 ComponentHeight: 0.55mm; HelpURL: \\cern.ch\dfs\Applications\Altium\Datasheets\R0603_NIC_NRC.pdf; Author: CERN DEM JLC; CreateDate: 03.12.2007; LatestRevisionDate: 13.03.2008
R31 = R0603_4K7_1%_0.1W_100PPM: Resistor - 1%; Part Description: General Purpose Thick Film Chip Resistor; Manufacturer: GENERIC; Manufacturer1 Part Number: NRC06F4701TRF; Power: 0.1W; TC: ±100ppm/°C; PressFit: No; Part Number: R0603_4K7_1%_0.1W_100PPM; Component Kind: Standard; Component Type: Standard; Pin Count: 2; Value: 4k7; Status: Preferred; Tolerance: ±1%; Manufacturer Part Number: R0603_4K7_1%_0.1W_100PPM; Case: 0603; Mounted: Yes; Sense: No; Socket: No; SMD: Yes; Manufacturer1 Example: NIC COMPONENT; Manufacturer1 ComponentHeight: 0.55mm; HelpURL: \\cern.ch\dfs\Applications\Altium\Datasheets\R0603_NIC_NRC.pdf; Author: CERN DEM JLC; CreateDate: 03.12.2007; LatestRevisionDate: 13.03.2008
R81 = R0603_270K_1%_0.1W_100PPM: Resistor - 1%; Part Description: General Purpose Thick Film Chip Resistor; Manufacturer: GENERIC; Manufacturer1 Part Number: NRC06F2703TRF; Power: 0.1W; TC: ±100ppm/°C; Part Number: R0603_270K_1%_0.1W_100PPM; Component Kind: Standard; Component Type: Standard; Pin Count: 2; Value: 270k; Status: Preferred; Tolerance: ±1%; Manufacturer Part Number: R0603_270K_1%_0.1W_100PPM; Case: 0603; Mounted: Yes; Sense: No; Socket: No; SMD: Yes; Manufacturer1 Example: NIC COMPONENT; Manufacturer1 ComponentHeight: 0.55mm; HelpURL: \\cern.ch\dfs\Applications\Altium\Datasheets\R0603_NIC_NRC.pdf; Author: CERN DEM JLC; CreateDate: 03.12.2007; LatestRevisionDate: 13.03.2008
R82 = R0603_82K_1%_0.1W_100PPM: Resistor - 1%; Part Description: General Purpose Thick Film Chip Resistor; Manufacturer: GENERIC; Manufacturer1 Part Number: NRC06F8202TRF; Power: 0.1W; TC: ±100ppm/°C; Part Number: R0603_82K_1%_0.1W_100PPM; Component Kind: Standard; Component Type: Standard; Pin Count: 2; Value: 82k; Status: Preferred; Tolerance: ±1%; Manufacturer Part Number: R0603_82K_1%_0.1W_100PPM; Case: 0603; Mounted: Yes; Sense: No; Socket: No; SMD: Yes; Manufacturer1 Example: NIC COMPONENT; Manufacturer1 ComponentHeight: 0.55mm; HelpURL: \\cern.ch\dfs\Applications\Altium\Datasheets\R0603_NIC_NRC.pdf; Author: CERN DEM JLC; CreateDate: 03.12.2007; LatestRevisionDate: 13.03.2008
R91 R110 = R0603_56K_1%_0.1W_100PPM: Resistor - 1%; Part Description: General Purpose Thick Film Chip Resistor; Manufacturer: GENERIC; Manufacturer1 Part Number: NRC06F5602TRF; Power: 0.1W; TC: ±100ppm/°C; Part Number: R0603_56K_1%_0.1W_100PPM; Component Kind: Standard; Component Type: Standard; Pin Count: 2; Value: 56k; Status: Preferred; Tolerance: ±1%; Manufacturer Part Number: R0603_56K_1%_0.1W_100PPM; Case: 0603; Mounted: Yes; Sense: No; Socket: No; SMD: Yes; Manufacturer1 Example: NIC COMPONENT; Manufacturer1 ComponentHeight: 0.55mm; HelpURL: \\cern.ch\dfs\Applications\Altium\Datasheets\R0603_NIC_NRC.pdf; Author: CERN DEM JLC; CreateDate: 03.12.2007; LatestRevisionDate: 13.03.2008
R94 = R0603_18K_1%_0.1W_100PPM: Resistor - 1%; Part Description: General Purpose Thick Film Chip Resistor; Manufacturer: GENERIC; Manufacturer1 Part Number: NRC06F1802TRF; Power: 0.1W; TC: ±100ppm/°C; Part Number: R0603_18K_1%_0.1W_100PPM; Component Kind: Standard; Component Type: Standard; Pin Count: 2; Value: 18k; Status: Preferred; Tolerance: ±1%; Manufacturer Part Number: R0603_18K_1%_0.1W_100PPM; Case: 0603; Mounted: Yes; Sense: No; Socket: No; SMD: Yes; Manufacturer1 Example: NIC COMPONENT; Manufacturer1 ComponentHeight: 0.55mm; HelpURL: \\cern.ch\dfs\Applications\Altium\Datasheets\R0603_NIC_NRC.pdf; Author: CERN DEM JLC; CreateDate: 03.12.2007; LatestRevisionDate: 13.03.2008
R95 = R0603_13K_1%_0.1W_100PPM: Resistor - 1%; Part Description: General Purpose Thick Film Chip Resistor; Manufacturer: GENERIC; Manufacturer1 Part Number: NRC06F1302TRF; Power: 0.1W; TC: ±100ppm/°C; Part Number: R0603_13K_1%_0.1W_100PPM; Component Kind: Standard; Component Type: Standard; Pin Count: 2; Value: 13k; Status: Preferred; Tolerance: ±1%; Manufacturer Part Number: R0603_13K_1%_0.1W_100PPM; Case: 0603; Mounted: Yes; Sense: No; Socket: No; SMD: Yes; Manufacturer1 Example: NIC COMPONENT; Manufacturer1 ComponentHeight: 0.55mm; HelpURL: \\cern.ch\dfs\Applications\Altium\Datasheets\R0603_NIC_NRC.pdf; Author: CERN DEM JLC; CreateDate: 03.12.2007; LatestRevisionDate: 13.03.2008
R96 = R0603_20K_1%_0.1W_100PPM: Resistor - 1%; Part Description: General Purpose Thick Film Chip Resistor; Manufacturer: GENERIC; Manufacturer1 Part Number: NRC06F2002TRF; Power: 0.1W; TC: ±100ppm/°C; Part Number: R0603_20K_1%_0.1W_100PPM; Component Kind: Standard; Component Type: Standard; Pin Count: 2; Value: 20k; Status: Preferred; Tolerance: ±1%; Manufacturer Part Number: R0603_20K_1%_0.1W_100PPM; Case: 0603; Mounted: Yes; Sense: No; Socket: No; SMD: Yes; Manufacturer1 Example: NIC COMPONENT; Manufacturer1 ComponentHeight: 0.55mm; HelpURL: \\cern.ch\dfs\Applications\Altium\Datasheets\R0603_NIC_NRC.pdf; Author: CERN DEM JLC; CreateDate: 03.12.2007; LatestRevisionDate: 13.03.2008
R97 = R0603_1K_1%_0.1W_100PPM: Resistor - 1%; Part Description: General Purpose Thick Film Chip Resistor; Manufacturer: GENERIC; Manufacturer1 Part Number: NRC06F1001TRF; Power: 0.1W; TC: ±100ppm/°C; Part Number: R0603_1K_1%_0.1W_100PPM; Component Kind: Standard; Component Type: Standard; Pin Count: 2; Value: 1k; Status: Preferred; Tolerance: ±1%; Manufacturer Part Number: R0603_1K_1%_0.1W_100PPM; Case: 0603; Mounted: Yes; Sense: No; Socket: No; SMD: Yes; Manufacturer1 Example: NIC COMPONENT; Manufacturer1 ComponentHeight: 0.55mm; HelpURL: \\cern.ch\dfs\Applications\Altium\Datasheets\R0603_NIC_NRC.pdf; Author: CERN DEM JLC; CreateDate: 03.12.2007; LatestRevisionDate: 13.03.2008
R98 = R0603_7K5_0.1%_0.063W_10PPM: Resistor - 0.1%; Part Description: Thin Film Chip Resistor; Manufacturer: GENERIC; Manufacturer1 Part Number: RN73C1J7K5BTDF; Power: 0.063W; TC: ±10ppm; Part Number: R0603_7K5_0.1%_0.063W_10PPM; Component Kind: Standard; Component Type: Standard; Pin Count: 2; Value: 7k5; Status: Not recommended; Tolerance: ±0.1%; Manufacturer Part Number: R0603_7K5_0.1%_0.063W_10PPM; Case: 0603; Mounted: Yes; Sense: No; Socket: No; SMD: Yes; Manufacturer1 Example: TYCO HOLSWORTHY; Manufacturer1 ComponentHeight: 0.5mm; HelpURL: \\cern.ch\dfs\Applications\Altium\Datasheets\R0603_Tyco_RN73.pdf; Author: CERN DEM JLC; CreateDate: 03.12.2007; LatestRevisionDate: 13.03.2008
TP1 = SMD_PAD_1.27X1.27MM: Part Description: 1.27mm x 1.27mm PCB Copper Area (SMD Test Point); Mounted: No; Part Number: SMD_PAD_1.27X1.27MM; Component Kind: Standard (No BOM); Component Type: Standard (No BOM); Pin Count: 1; Family: Test Point; Socket: No; SMD: Yes; Sense: No; Status: None; ComponentHeight: 0mm; HelpURL: Undefined; Author: CERN DEM JLC; CreateDate: 12.01.2008; LatestRevisionDate: 12.01.2008; PackageDescription: 1.27mm x 1.27mm PCB Copper Area (SMD Test Point)

## Sheet TEMP_MGT.SchDoc
size A4
Used 3 times, as channels U_TEMP_MGT, U_TEMP_MGT, U_TEMP_MGT. Parts and nets are listed once, with the designators drawn on the sheet.
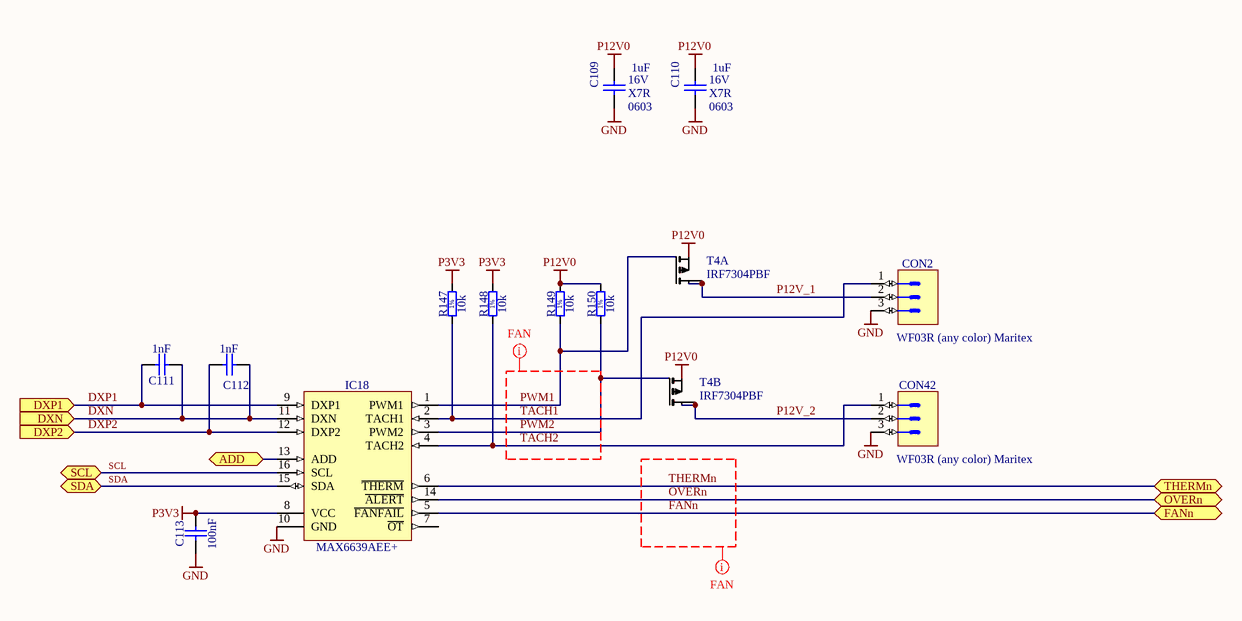
[diagram p4: TEMP_MGT.SchDoc]

### Parts
C109  1uF  Voltage: 16V  TC: X7R  Case: 0603  [CAPC1608X87N]
C110  1uF  Voltage: 16V  TC: X7R  Case: 0603  [CAPC1608X87N]
C111  1nF  [CAPC1608X87N]
C112  1nF  [CAPC1608X87N]
C113  100nF  [CAPC0603X33N]
CON2  WF03R (any color) Maritex  [MOLEX_22-05-7038]
CON42  WF03R (any color) Maritex  [MOLEX_22-05-7038]
IC18  MAX6639AEE+  [SOP63P600X175-16N]
R147  10k  [RESC1005X40N]
R148  10k  [RESC1005X40N]
R149  10k  [RESC1005X40N]
R150  10k  [RESC1005X40N]
T4  IRF7304PBF  [so-8]  (parts A,B of 2)

### Ports
ADD (bidir), DXN (in), DXP1 (in), DXP2 (in), FANn (bidir), OVERn (bidir), SCL (bidir), SDA (bidir), THERMn (bidir)

### Nets
GND: C109.1 C110.1 C113.1 CON2.3 CON42.3 IC18.10(GND)
P3V3: C113.2 IC18.8(VCC) R147.2 R148.2
P12V0: C109.2 C110.2 R149.2 R150.2 T4.1(S1) T4.3(S2)
ADD: IC18.13(ADD) ; port ADD
DXN: C111.1 C112.1 IC18.11(DXN) ; port DXN
DXP1: C111.2 IC18.9(DXP1) ; port DXP1
DXP2: C112.2 IC18.12(DXP2) ; port DXP2
FANn: IC18.5(~{FANFAIL}) ; port FANn
OVERn: IC18.14(~{ALERT}) ; port OVERn
P12V_1: CON2.2 T4.7(D1) T4.8(D1)
P12V_2: CON42.2 T4.5(D2) T4.6(D2)
PWM1: IC18.1(PWM1) R149.1 T4.2(G1)
PWM2: IC18.3(PWM2) R150.1 T4.4(G2)
SCL: IC18.16(SCL) ; port SCL
SDA: IC18.15(SDA) ; port SDA
TACH1: CON2.1 IC18.2(TACH1) R147.1
TACH2: CON42.1 IC18.4(TACH2) R148.1
THERMn: IC18.6(~{THERM}) ; port THERMn

Not connected (* = marked no-connect by the designer): IC18 7(~{OT})

### Channels
U_TEMP_MGT: designators end in _1; ports ADD=GND DXN=DXN DXP1=DXP1 DXP2=DXP2 FANn=FANn OVERn=OVERn SCL=I2C_SCL SDA=I2C_SDA THERMn=THERMn
U_TEMP_MGT: designators end in _2; ports ADD=NetIC18_2_13 DXN=DXN DXP1=DXP1 DXP2=DXP2 FANn=FANn OVERn=OVERn SCL=I2C_SCL SDA=I2C_SDA THERMn=THERMn
U_TEMP_MGT: designators end in _3; ports ADD=P3V3 DXN=DXN DXP1=DXP1 DXP2=DXP2 FANn=FANn OVERn=OVERn SCL=I2C_SCL SDA=I2C_SDA THERMn=THERMn

### Layout directives
net class FAN: FANn, OVERn, PWM1, PWM2, TACH1, TACH2, THERMn

### Notes on the sheet
- (in symbol R0402_10K_1%_0.0625W_100PPM) 1%

### Library data of the parts
C109 C110 = CC0603_1UF_16V_10%_X7R: Non-polarised capacitor; Part Description: SMD Multilayer Chip Ceramic Capacitor; Manufacturer: GENERIC; Manufacturer1 Part Number: 223824613663; Tolerance: ±10%; Table: Capacitors SMD; Part Number: CC0603_1UF_16V_10%_X7R; Component Kind: Standard; Component Type: Standard; Pin Count: 2; Value: 1uF; Status: Preferred; Manufacturer Part Number: CC0603_1uF_16V_10%_X7R; Mounted: Yes; Socket: No; SMD: Yes; Manufacturer1 Example: PHYCOMP; Manufacturer1 ComponentHeight: 0.87mm; HelpURL: \\cern.ch\dfs\Applications\Altium\Datasheets\CC0805_X5R_PHYCOMP_HC.pdf; Author: CERN DEM JLC; CreateDate: 12/3/2007; LatestRevisionDate: 12/3/2007
C111 C112 = CC0603_1NF_50V_10%_X7R: Non-polarised capacitor; Part Description: SMD Multilayer Chip Ceramic Capacitor; Manufacturer: GENERIC; Manufacturer1 Part Number: 223858615623; Voltage: 50V; TC: X7R; Tolerance: ±10%; Table: Capacitors SMD; Part Number: CC0603_1NF_50V_10%_X7R; Component Kind: Standard; Component Type: Standard; Pin Count: 2; Value: 1nF; Status: Preferred; Manufacturer Part Number: CC0603_1NF_50V_10%_X7R; Case: 0603; Mounted: Yes; Socket: No; SMD: Yes; Manufacturer1 Example: PHYCOMP; Manufacturer1 ComponentHeight: 0.87mm; HelpURL: \\cern.ch\dfs\Applications\Altium\Datasheets\CC0603_X7R_PHYCOMP.pdf; Author: CERN DEM JLC; CreateDate: 2007-12-03; LatestRevisionDate: 2007-12-03
C113 = CC0201_100NF_6.3V_10%_X5R: Non-polarised capacitor; Part Description: SMD Multilayer Chip Ceramic Capacitor; Manufacturer: GENERIC; Manufacturer1 Part Number: 02016D104KAT2A; Voltage: 6.3V; TC: X5R; Tolerance: ±10%; Table: Capacitors SMD; Part Number: CC0201_100NF_6.3V_10%_X5R; Component Kind: Standard; Component Type: Standard; Pin Count: 2; Value: 100nF; Status: Not Recommended; Manufacturer Part Number: CC0201_100NF_6.3V_10%_X5R; Case: 0201; Mounted: Yes; Socket: No; SMD: Yes; Manufacturer1 Example: AVX; Manufacturer1 ComponentHeight: 0.33mm; HelpURL: \\cern.ch\dfs\Applications\Altium\Datasheets\CC0201_X5R_AVX.pdf; Author: CERN DEM JLC; CreateDate: 2007-12-03; LatestRevisionDate: 2007-12-03
CON2 CON42 = MOLEX_22-05-7038: Connector 3 Male; Part Description: 2.54mm (.100") Pitch KK® Wire-To-Board Header, Right Angle, With Friction Lock, 3 Circuits; Manufacturer: MOLEX; Part Number: MOLEX_22-05-7038; Component Kind: Standard; Component Type: Standard; Pin Count: 3; Family: KK®; Mounted: Yes; Socket: No; SMD: No; Status: None; Manufacturer Part Number: 22-05-7038; ComponentHeight: 5.8mm; HelpURL: \\cern.ch\dfs\Applications\Altium\Datasheets\MOLEX_22-05-7038.pdf; Author: CERN DEM JLC; CreateDate: 2012-09-19; LatestRevisionDate: 2012-09-19; Table: MOLEX
IC18 = MAX6639AEE+: 2-Channel Temperature Monitor with Dual, Automatic, PWM Fan-Speed Controller; Manufacturer: MAXIM; Table: Analog & Interface; Part Number: MAX6639AEE+; Component Kind: Standard; Component Type: Standard; Device: MAX6639AEE+; PackageDescription: SOP, 0.635mm pitch; 16 pin, 3.9mm W X 4.895mm L X 1.75mm H Body, IPC Medium Density; Part Description: 2-Channel Temperature Monitor with Dual, Automatic, PWM Fan-Speed Controller; Manufacturer Part Number: MAX6639AEE+; Pin Count: 16; Case: SSOP16; Mounted: Yes; Socket: No; SMD: Yes; ComponentHeight: 1.75mm; Author: CERN DEM JLC; HelpURL: \\cern.ch\dfs\Applications\Altium\Datasheets\MAX6639AEE+.pdf; CreateDate: 2012-08-15; LatestRevisionDate: 2012-08-15
R147-R150 = R0402_10K_1%_0.0625W_100PPM: Resistor - 1%; Part Description: General Purpose Thick Film Chip Resistor; Manufacturer: GENERIC; Manufacturer1 Part Number: 232270671003L; TC: ±100ppm/°C; Table: Resistors SMD; Part Number: R0402_10K_1%_0.0625W_100PPM; Component Kind: Standard; Component Type: Standard; Pin Count: 2; Value: 10k; Status: Not recommended; Power: 0.0625W; Tolerance: ±1%; Manufacturer Part Number: R0402_10K_1%_0.0625W_100PPM; Case: 0402; Mounted: Yes; Socket: No; SMD: Yes; Manufacturer1 Example: YAGEO PHYCOMP; Manufacturer1 ComponentHeight: 0.4mm; HelpURL: \\cern.ch\dfs\Applications\Altium\Datasheets\R0402_Phycomp_RC0402.pdf; Author: CERN DEM JLC; CreateDate: 2007-12-03; LatestRevisionDate: 2012-10-17
T4 = Q_IRF7304: dual PMOS   20V 4,3A 2,0W 0,09R

## Nets that join several sheets
GND: PA_CTRL_TOP (20 pins), CPU (40 pins), U_PA_Channel (50 pins), U_PA_Channel (50 pins), U_PA_Channel (50 pins), U_PA_Channel (50 pins), U_PA_Channel (50 pins), U_PA_Channel (50 pins), U_PA_Channel (50 pins), U_PA_Channel (50 pins), Power_Supply (50 pins), U_TEMP_MGT (7 pins), U_TEMP_MGT (6 pins), U_TEMP_MGT (6 pins)
N8V0: U_PA_Channel (C42_1.2 IC13_1.2), U_PA_Channel (C42_2.2 IC13_2.2), U_PA_Channel (C42_3.2 IC13_3.2), U_PA_Channel (C42_4.2 IC13_4.2), U_PA_Channel (C42_5.2 IC13_5.2), U_PA_Channel (C42_6.2 IC13_6.2), U_PA_Channel (C42_7.2 IC13_7.2), U_PA_Channel (C42_8.2 IC13_8.2), Power_Supply (21 pins)
P3V3: PA_CTRL_TOP (28 pins), CPU (35 pins), U_PA_Channel (16 pins), U_PA_Channel (16 pins), U_PA_Channel (16 pins), U_PA_Channel (16 pins), U_PA_Channel (16 pins), U_PA_Channel (16 pins), U_PA_Channel (16 pins), U_PA_Channel (16 pins), Power_Supply (13 pins), U_TEMP_MGT (C113_1.2 IC18_1.8 R147_1.2 R148_1.2), U_TEMP_MGT (C113_2.2 IC18_2.8 R147_2.2 R148_2.2), U_TEMP_MGT (5 pins)
P5V0: U_PA_Channel (F1_1.1), U_PA_Channel (F1_2.1), U_PA_Channel (F1_3.1), U_PA_Channel (F1_4.1), U_PA_Channel (F1_5.1), U_PA_Channel (F1_6.1), U_PA_Channel (F1_7.1), U_PA_Channel (F1_8.1), Power_Supply (5 pins)
P6V5: U_PA_Channel (C19_1.2 IC3_1.2), U_PA_Channel (C19_2.2 IC3_2.2), U_PA_Channel (C19_3.2 IC3_3.2), U_PA_Channel (C19_4.2 IC3_4.2), U_PA_Channel (C19_5.2 IC3_5.2), U_PA_Channel (C19_6.2 IC3_6.2), U_PA_Channel (C19_7.2 IC3_7.2), U_PA_Channel (C19_8.2 IC3_8.2), Power_Supply (9 pins)
P12V0: Power_Supply (11 pins), U_TEMP_MGT (6 pins), U_TEMP_MGT (6 pins), U_TEMP_MGT (6 pins)
P30V0: U_PA_Channel (C32_1.2 U1_1.1), U_PA_Channel (C32_2.2 U1_2.1), U_PA_Channel (C32_3.2 U1_3.1), U_PA_Channel (C32_4.2 U1_4.1), U_PA_Channel (C32_5.2 U1_5.1), U_PA_Channel (C32_6.2 U1_6.1), U_PA_Channel (C32_7.2 U1_7.1), U_PA_Channel (C32_8.2 U1_8.1), Power_Supply (C63.2 L4.2 R96.2 R110.2)
ADC_IN0: CPU (IC1.34), U_PA_Channel (J1_1.5)
ADC_IN1: CPU (IC1.35), U_PA_Channel (J1_1.10)
ADC_IN2: CPU (IC1.36), U_PA_Channel (J1_2.5)
ADC_IN3: CPU (IC1.37), U_PA_Channel (J1_2.10)
ADC_IN4: CPU (IC1.18), U_PA_Channel (J1_3.5)
ADC_IN5: CPU (IC1.19), U_PA_Channel (J1_3.10)
ADC_IN6: CPU (IC1.20), U_PA_Channel (J1_4.5)
ADC_IN7: CPU (IC1.21), U_PA_Channel (J1_4.10)
ADC_IN8: CPU (IC1.22), U_PA_Channel (J1_5.5)
ADC_IN9: CPU (IC1.13), U_PA_Channel (J1_5.10)
ADC_IN10: CPU (IC1.26), U_PA_Channel (J1_6.5)
ADC_IN11: CPU (IC1.27), U_PA_Channel (J1_6.10)
ADC_IN12: CPU (IC1.28), U_PA_Channel (J1_7.5)
ADC_IN13: CPU (IC1.29), U_PA_Channel (J1_7.10)
ADC_IN14: CPU (IC1.14), U_PA_Channel (J1_8.5)
ADC_IN15: CPU (IC1.15), U_PA_Channel (J1_8.10)
ALERT: CPU (IC1.77), U_PA_Channel (IC9_1.2 LD4_1.1 R57_1.1)
ALERT: CPU (IC1.78), U_PA_Channel (IC9_2.2 LD4_2.1 R57_2.1)
ALERT: CPU (IC1.79), U_PA_Channel (IC9_3.2 LD4_3.1 R57_3.1)
ALERT: CPU (IC1.80), U_PA_Channel (IC9_4.2 LD4_4.1 R57_4.1)
ALERT: CPU (IC1.81), U_PA_Channel (IC9_5.2 LD4_5.1 R57_5.1)
ALERT: CPU (IC1.82), U_PA_Channel (IC9_6.2 LD4_6.1 R57_6.1)
ALERT: CPU (IC1.85), U_PA_Channel (IC9_7.2 LD4_7.1 R57_7.1)
ALERT: CPU (IC1.86), U_PA_Channel (IC9_8.2 LD4_8.1 R57_8.1)
DXN: PA_CTRL_TOP (J4.2), U_TEMP_MGT (C111_1.1 C112_1.1 IC18_1.11)
DXN: PA_CTRL_TOP (J4.5), U_TEMP_MGT (C111_2.1 C112_2.1 IC18_2.11)
DXN: PA_CTRL_TOP (J4.8), U_TEMP_MGT (C111_3.1 C112_3.1 IC18_3.11)
DXP1: PA_CTRL_TOP (J4.1), U_TEMP_MGT (C111_1.2 IC18_1.9)
DXP1: PA_CTRL_TOP (J4.4), U_TEMP_MGT (C111_2.2 IC18_2.9)
DXP1: PA_CTRL_TOP (J4.7), U_TEMP_MGT (C111_3.2 IC18_3.9)
DXP2: PA_CTRL_TOP (J4.3), U_TEMP_MGT (C112_1.2 IC18_1.12)
DXP2: PA_CTRL_TOP (J4.6), U_TEMP_MGT (C112_2.2 IC18_2.12)
DXP2: PA_CTRL_TOP (J4.9), U_TEMP_MGT (C112_3.2 IC18_3.12)
EN_PWR_CH0: CPU (IC1.114), U_PA_Channel (R85_1.2 R88_1.2)
EN_PWR_CH1: CPU (IC1.115), U_PA_Channel (R85_2.2 R88_2.2)
EN_PWR_CH2: CPU (IC1.116), U_PA_Channel (R85_3.2 R88_3.2)
EN_PWR_CH3: CPU (IC1.117), U_PA_Channel (R85_4.2 R88_4.2)
EN_PWR_CH4: CPU (IC1.118), U_PA_Channel (R85_5.2 R88_5.2)
EN_PWR_CH5: CPU (IC1.119), U_PA_Channel (R85_6.2 R88_6.2)
EN_PWR_CH6: CPU (IC1.122), U_PA_Channel (R85_7.2 R88_7.2)
EN_PWR_CH7: CPU (IC1.123), U_PA_Channel (R85_8.2 R88_8.2)
FANn: PA_CTRL_TOP (R24.2), CPU (IC1.45), U_TEMP_MGT (IC18_1.5), U_TEMP_MGT (IC18_2.5), U_TEMP_MGT (IC18_3.5)
I2C0_SCL: PA_CTRL_TOP (IC11.2 R63.1), U_PA_Channel (IC9_1.3 IC15_1.5 J1_1.9)
I2C0_SDA: PA_CTRL_TOP (IC11.1 R61.1), U_PA_Channel (IC9_1.4 IC15_1.4 J1_1.4)
I2C1_SCL: PA_CTRL_TOP (IC11.4 R65.1), U_PA_Channel (IC9_2.3 IC15_2.5 J1_2.9)
I2C1_SDA: PA_CTRL_TOP (IC11.3 R64.1), U_PA_Channel (IC9_2.4 IC15_2.4 J1_2.4)
I2C2_SCL: PA_CTRL_TOP (IC11.6 R70.1), U_PA_Channel (IC9_3.3 IC15_3.5 J1_3.9)
I2C2_SDA: PA_CTRL_TOP (IC11.5 R68.1), U_PA_Channel (IC9_3.4 IC15_3.4 J1_3.4)
I2C3_SCL: PA_CTRL_TOP (IC11.8 R72.1), U_PA_Channel (IC9_4.3 IC15_4.5 J1_4.9)
I2C3_SDA: PA_CTRL_TOP (IC11.7 R71.1), U_PA_Channel (IC9_4.4 IC15_4.4 J1_4.4)
I2C4_SCL: PA_CTRL_TOP (IC11.11 R74.1), U_PA_Channel (IC9_5.3 IC15_5.5 J1_5.9)
I2C4_SDA: PA_CTRL_TOP (IC11.10 R73.1), U_PA_Channel (IC9_5.4 IC15_5.4 J1_5.4)
I2C5_SCL: PA_CTRL_TOP (IC11.13 R76.1), U_PA_Channel (IC9_6.3 IC15_6.5 J1_6.9)
I2C5_SDA: PA_CTRL_TOP (IC11.12 R75.1), U_PA_Channel (IC9_6.4 IC15_6.4 J1_6.4)
I2C6_SCL: PA_CTRL_TOP (IC11.15 R78.1), U_PA_Channel (IC9_7.3 IC15_7.5 J1_7.9)
I2C6_SDA: PA_CTRL_TOP (IC11.14 R77.1), U_PA_Channel (IC9_7.4 IC15_7.4 J1_7.4)
I2C7_SCL: PA_CTRL_TOP (IC11.17 R80.1), U_PA_Channel (IC9_8.3 IC15_8.5 J1_8.9)
I2C7_SDA: PA_CTRL_TOP (IC11.16 R79.1), U_PA_Channel (IC9_8.4 IC15_8.4 J1_8.4)
I2C_SCL: PA_CTRL_TOP (IC11.19 J2.23 R62.2), CPU (IC1.136), U_TEMP_MGT (IC18_1.16), U_TEMP_MGT (IC18_2.16), U_TEMP_MGT (IC18_3.16)
I2C_SDA: PA_CTRL_TOP (IC11.20 J2.24 R60.2), CPU (IC1.137), U_TEMP_MGT (IC18_1.15), U_TEMP_MGT (IC18_2.15), U_TEMP_MGT (IC18_3.15)
Input_overdrive: CPU (IC1.59), U_PA_Channel (J1_1.3)
Input_overdrive: CPU (IC1.60), U_PA_Channel (J1_2.3)
Input_overdrive: CPU (IC1.63), U_PA_Channel (J1_3.3)
Input_overdrive: CPU (IC1.64), U_PA_Channel (J1_4.3)
Input_overdrive: CPU (IC1.65), U_PA_Channel (J1_5.3)
Input_overdrive: CPU (IC1.66), U_PA_Channel (J1_6.3)
Input_overdrive: CPU (IC1.67), U_PA_Channel (J1_7.3)
Input_overdrive: CPU (IC1.68), U_PA_Channel (J1_8.3)
NetD2_1_1: CPU (IC1.89), U_PA_Channel (D2_1.1), U_PA_Channel (D2_2.1), U_PA_Channel (D2_3.1), U_PA_Channel (D2_4.1), U_PA_Channel (D2_5.1), U_PA_Channel (D2_6.1), U_PA_Channel (D2_7.1), U_PA_Channel (D2_8.1), Power_Supply (5 pins)
NetIC1_40: PA_CTRL_TOP (J2.2), CPU (IC1.40)
NetIC1_41: PA_CTRL_TOP (J2.4), CPU (IC1.41)
NetIC1_42: PA_CTRL_TOP (J2.8), CPU (IC1.42)
NetIC1_43: PA_CTRL_TOP (J2.6), CPU (IC1.43)
NetIC1_73: PA_CTRL_TOP (J2.14), CPU (IC1.73)
NetIC1_74: PA_CTRL_TOP (J2.16), CPU (IC1.74)
NetIC1_76: PA_CTRL_TOP (J2.17), CPU (IC1.76)
NetIC1_90: PA_CTRL_TOP (J2.10), CPU (IC1.90)
NetIC1_91: PA_CTRL_TOP (J2.12), CPU (IC1.91)
NetIC1_102: PA_CTRL_TOP (J2.29), CPU (IC1.102)
NetIC1_103: PA_CTRL_TOP (J2.27), CPU (IC1.103)
NetIC1_104: PA_CTRL_TOP (J2.28), CPU (IC1.104)
NetIC1_139: PA_CTRL_TOP (J2.18), CPU (IC1.139)
NetJ2_26: PA_CTRL_TOP (J2.26), CPU (R3.2)
OVERn: PA_CTRL_TOP (R23.2), CPU (IC1.56), U_TEMP_MGT (IC18_1.14), U_TEMP_MGT (IC18_2.14), U_TEMP_MGT (IC18_3.14)
P2V5_REF: PA_CTRL_TOP (C52.1 IC10.2), CPU (FB2.2), U_PA_Channel (C51_1.1 IC9_1.15), U_PA_Channel (C51_2.1 IC9_2.15), U_PA_Channel (C51_3.1 IC9_3.15), U_PA_Channel (C51_4.1 IC9_4.15), U_PA_Channel (C51_5.1 IC9_5.15), U_PA_Channel (C51_6.1 IC9_6.15), U_PA_Channel (C51_7.1 IC9_7.15), U_PA_Channel (C51_8.1 IC9_8.15)
PA_CH_RESETn: CPU (IC1.140), U_PA_Channel (IC9_1.1), U_PA_Channel (IC9_2.1), U_PA_Channel (IC9_3.1), U_PA_Channel (IC9_4.1), U_PA_Channel (IC9_5.1), U_PA_Channel (IC9_6.1), U_PA_Channel (IC9_7.1), U_PA_Channel (IC9_8.1)
PA_SIG_GND: CPU (R83.2), U_PA_Channel (J1_1.15), U_PA_Channel (J1_2.15), U_PA_Channel (J1_3.15), U_PA_Channel (J1_4.15), U_PA_Channel (J1_5.15), U_PA_Channel (J1_6.15), U_PA_Channel (J1_7.15), U_PA_Channel (J1_8.15)
PGOOD_N7V5: CPU (IC1.57), Power_Supply (IC5.8 R25.2 TP1.1)
SIG_ON_CH0: CPU (IC1.93), U_PA_Channel (R50_1.1 R84_1.2)
SIG_ON_CH1: CPU (IC1.124), U_PA_Channel (R50_2.1 R84_2.2)
SIG_ON_CH2: CPU (IC1.125), U_PA_Channel (R50_3.1 R84_3.2)
SIG_ON_CH3: CPU (IC1.126), U_PA_Channel (R50_4.1 R84_4.2)
SIG_ON_CH4: CPU (IC1.127), U_PA_Channel (R50_5.1 R84_5.2)
SIG_ON_CH5: CPU (IC1.128), U_PA_Channel (R50_6.1 R84_6.2)
SIG_ON_CH6: CPU (IC1.129), U_PA_Channel (R50_7.1 R84_7.2)
SIG_ON_CH7: CPU (IC1.132), U_PA_Channel (R50_8.1 R84_8.2)
SWn1: PA_CTRL_TOP (J2.19), CPU (IC1.54 R112.1)
SWn2: PA_CTRL_TOP (J2.20), CPU (IC1.55 R113.1)
THERMn: PA_CTRL_TOP (R22.2), CPU (IC1.44), U_TEMP_MGT (IC18_1.6), U_TEMP_MGT (IC18_2.6), U_TEMP_MGT (IC18_3.6)
USER_IO0: CPU (IC1.141), U_PA_Channel (J1_1.1)
USER_IO1: CPU (IC1.142), U_PA_Channel (J1_2.1)
USER_IO2: CPU (IC1.1), U_PA_Channel (J1_3.1)
USER_IO3: CPU (IC1.2), U_PA_Channel (J1_4.1)
USER_IO4: CPU (IC1.3), U_PA_Channel (J1_5.1)
USER_IO5: CPU (IC1.4), U_PA_Channel (J1_6.1)
USER_IO6: CPU (IC1.5), U_PA_Channel (J1_7.1)
USER_IO7: CPU (IC1.58), U_PA_Channel (J1_8.1)